# Altium schematic sheet ESP_32.SchDoc
size A
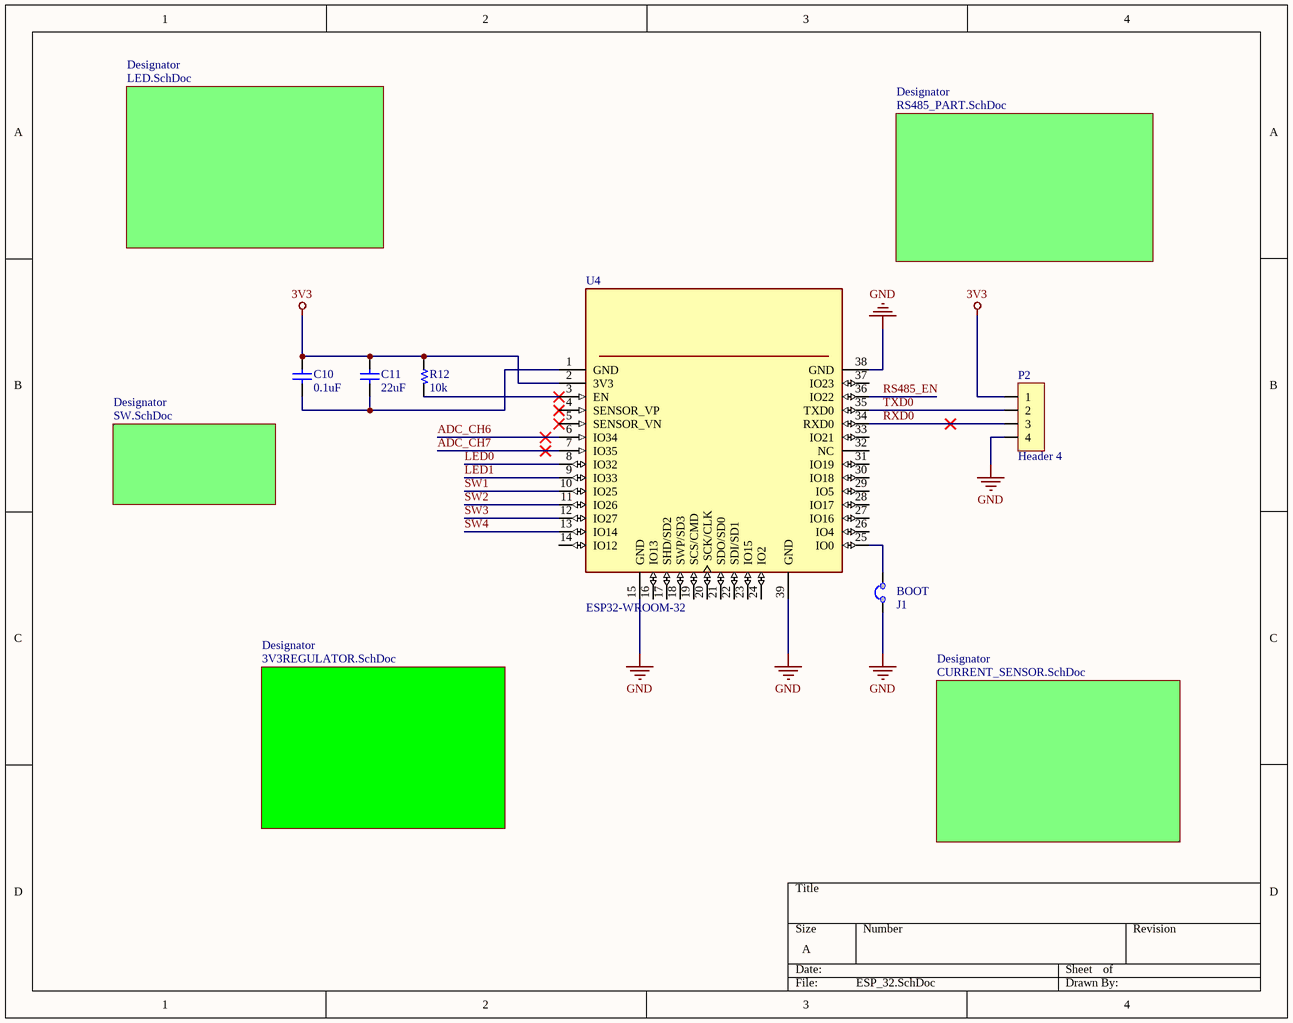
[diagram p0: ESP_32.SchDoc]

## Parts
C10  0.1uF  [C 1206]
C11  22uF  [C 1206]
J1  JUMP 2  [JUMP/2/Close]  (value not drawn)  (no BOM)
P2  Header 4  [HDR/Header/4]
R12  10k  [R 0603]
U4  ESP32-WROOM-32  [MODULE_ESP32-WROOM-32]

## Sub-sheets
Designator = 3V3REGULATOR.SchDoc: no entries
Designator = CURRENT_SENSOR.SchDoc: no entries
Designator = RS485_PART.SchDoc: no entries
Designator = LED.SchDoc: no entries
Designator = SW.SchDoc: no entries

## Nets
3V3: C10.1 C11.1 P2.1 R12.1 U4.2(3V3)
GND: J1.1 P2.4 U4.15(GND) U4.38(GND) U4.39(GND)
ADC_CH6: U4.6(IO34)
ADC_CH7: U4.7(IO35)
LED0: U4.8(IO32)
LED1: U4.9(IO33)
RS485_EN: U4.36(IO22)
RXD0: P2.3 U4.34(RXD0)
SW1: U4.10(IO25)
SW2: U4.11(IO26)
SW3: U4.12(IO27)
SW4: U4.13(IO14)
TXD0: P2.2 U4.35(TXD0)
NetC10_2: C10.2 C11.2 U4.1(GND)
NetJ1_2: J1.2 U4.25(IO0)
NetR12_2: R12.2 U4.3(EN)

Not connected (* = marked no-connect by the designer): U4 4(SENSOR_VP)* 5(SENSOR_VN)* 14(IO12) 16(IO13) 17(SHD/SD2) 18(SWP/SD3) 19(SCS/CMD) 20(SCK/CLK) 21(SDO/SD0) 22(SDI/SD1) 23(IO15) 24(IO2) 26(IO4) 27(IO16) 28(IO17) 29(IO5) 30(IO18) 31(IO19) 32(NC) 33(IO21) 37(IO23)

## Notes on the sheet
- (near J1) BOOT

## Library data of the parts
C10 C11 = Capacitor NP: Capacitor non-pol
P2 = Header 4: Header, 4-Pin
R12 = Resistor
U4 = ESP32-WROOM-32: Bluetooth, WiFi 802.11b/g/n, Bluetooth v4.2 + EDR, Class 1, 2 and 3 Transceiver Module 2.4GHz ~ 2.5GHz Integrated, Trace Surface Mount; MF: Espressif Systems; MP: ESP32-WROOM-32D; Price: None; Package: Module Espressif Systems; Availability: Unavailable; SnapEDA_Link: https://www.snapeda.com/parts/ESP32-WROOM-32D/Espressif%20Systems/view-part/2768115/?ref=snap; Value: *